# EAGLE design Temperature Sensor (EAGLE 7.7.0)
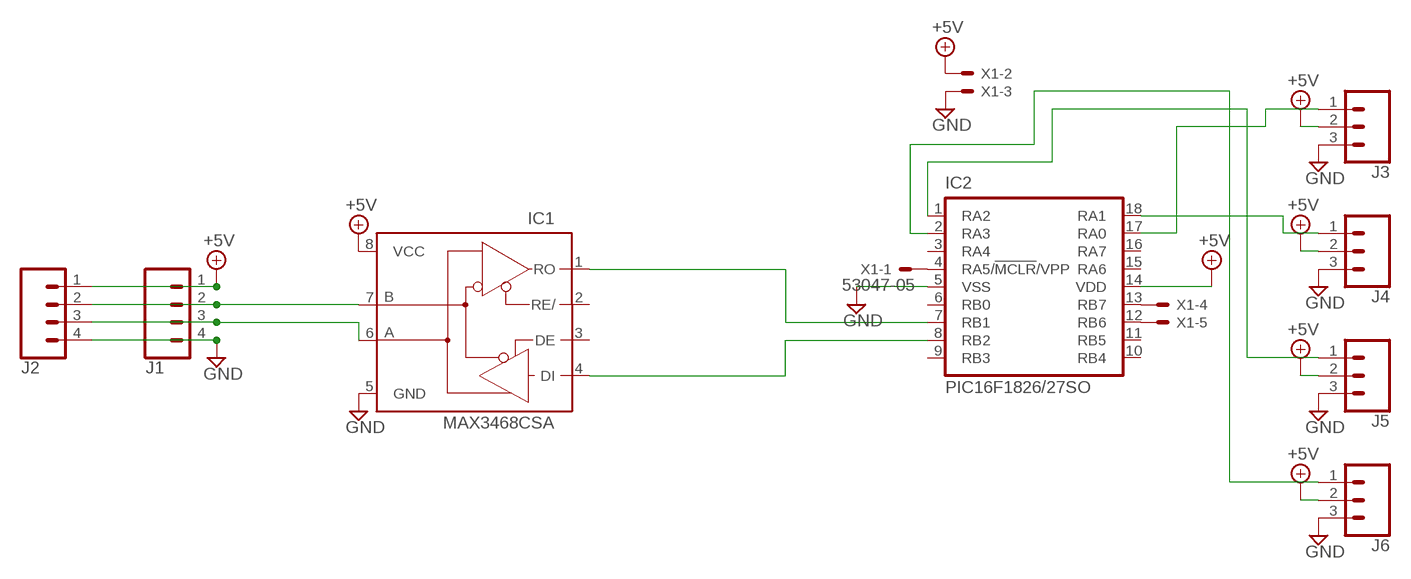
[diagram p0: schematic, sheet 1]

## Parts
IC1  MAX3468CSA  [SO08]
IC2  PIC16F1826/27SO  [SO-18W]
J1  CONN_04SCREW  [SCREWTERMINAL-3.5MM-4]
J2  CONN_04SCREW  [SCREWTERMINAL-3.5MM-4]
J3  CONN_03  [1X03]
J4  CONN_03  [1X03]
J5  CONN_03  [1X03]
J6  CONN_03  [1X03]
X1  53047-05  [53047-05]

## Nets
+5V: IC1.8(VCC) IC2.14(VDD) J1.1 J2.1 J3.2 J4.2 J5.2 J6.2 X1.2
GND: IC1.5(GND) IC2.5(VSS) J1.4 J2.4 J3.3 J4.3 J5.3 J6.3 X1.3
N$1: IC1.1(RO) IC2.7(RB1)
N$2: IC1.4(DI) IC2.8(RB2)
N$5: IC2.4(RA5/!MCLR!/VPP) X1.1
N$6: IC2.13(RB7) X1.4
N$7: IC2.12(RB6) X1.5
N$8: IC1.7(B) J1.2 J2.2
N$9: IC1.6(A) J1.3 J2.3
N$10: IC2.17(RA0) J3.1
N$11: IC2.18(RA1) J4.1
N$12: IC2.1(RA2) J5.1
N$13: IC2.2(RA3) J6.1
Unconnected: IC1.2(RE/) IC1.3(DE) IC2.3(RA4) IC2.6(RB0) IC2.9(RB3) IC2.10(RB4) IC2.11(RB5) IC2.15(RA6) IC2.16(RA7)

## Library data of the parts
IC1 = maxim:MAX34*: +5V, Fail-Safe, 40Mbps, Profibus RS-485/RS-422 Transceivers Source: MAX3465-MAX3469.pdf; MPN: MAX3468CSA+; OC_FARNELL: unknown; OC_NEWARK: 76K6721
IC2 = microchip:PIC16*F1826/27: 18/20/28-Pin Flash Microcontrollers with nanoWatt XLP Technology Source: www.microchip.com PIC16F1827.pdf
J1 J2 = SparkFun-Connectors:CONN_04: Multi connection point. Often used as Generic Header-pin footprint for 0.1 inch spaced/style header connections On any of the 0.1 inch spaced packages, you can populate with these: Break Away Headers - Straight <https://www.sparkfun.com/products/116> (PRT-00116) Break Away Male Headers - Right Angle <https://www.sparkfun.com/products/553> (PRT-00553) Female Headers <https://www.sparkfun.com/products/115> (PRT-00115) Break Away Headers - Machine Pin <https://www.sparkfun.com/products/117> (PRT-00117) Break Away Female Headers - Swiss Machine Pin <https://www.sparkfun.com/products/743> (PRT-00743) For SCREWTERMINALS and SPRING TERMINALS visit here: Screw Terimnals on SparkFun.com <https://www.sparkfun.com/search/results?term=Screw+Terminals> (5mm/3.5mm/2.54mm spacing) This device is also useful as a general connection point to wire up your design to another part of your project. Our various solder wires solder well into these plated through hole pads. Hook-Up Wire - Assortment (Stranded, 22 AWG) <https://www.sparkfun.com/products/11375> (PRT-11375) Hook-Up Wire - Assortment (Solid Core, 22 AWG) <https://www.sparkfun.com/products/11367> (PRT-11367) View the entire wire category on our website here <https://www.sparkfun.com/categories/141> Special notes: Molex polarized connector foot print use with SKU : PRT-08231 with associated crimp pins and housings. 1MM SMD Version SKU: PRT-10208; PROD_ID: 2xCONN-08399; SF_ID: 2xPRT-08084
J3-J6 = SparkFun-Connectors:CONN_03: Multi connection point. Often used as Generic Header-pin footprint for 0.1 inch spaced/style header connections On any of the 0.1 inch spaced packages, you can populate with these: Break Away Headers - Straight <https://www.sparkfun.com/products/116> (PRT-00116) Break Away Male Headers - Right Angle <https://www.sparkfun.com/products/553> (PRT-00553) Female Headers <https://www.sparkfun.com/products/115> (PRT-00115) Break Away Headers - Machine Pin <https://www.sparkfun.com/products/117> (PRT-00117) Break Away Female Headers - Swiss Machine Pin <https://www.sparkfun.com/products/743> (PRT-00743) Stackable Header - 3 Pin (Female, 0.1") <https://www.sparkfun.com/products/13875> (PRT-13875) For SCREWTERMINALS and SPRING TERMINALS visit here: Screw Terimnals on SparkFun.com <https://www.sparkfun.com/search/results?term=Screw+Terminals> (5mm/3.5mm/2.54mm spacing) This device is also useful as a general connection point to wire up your design to another part of your project. Our various solder wires solder well into these plated through hole pads. Hook-Up Wire - Assortment (Stranded, 22 AWG) <https://www.sparkfun.com/products/11375> (PRT-11375) Hook-Up Wire - Assortment (Solid Core, 22 AWG) <https://www.sparkfun.com/products/11367> (PRT-11367) View the entire wire category on our website here <https://www.sparkfun.com/categories/141> Special notes: Molex polarized connector foot print use with SKU : PRT-08232 with associated crimp pins and housings.
X1 = con-molex:53?-05: CONNECTOR wire to board 1.25 mm (.049 inch) pitch header; MF: MOLEX; MPN: 53047-0510; OC_FARNELL: 9732861; OC_NEWARK: 38C9901

## Board
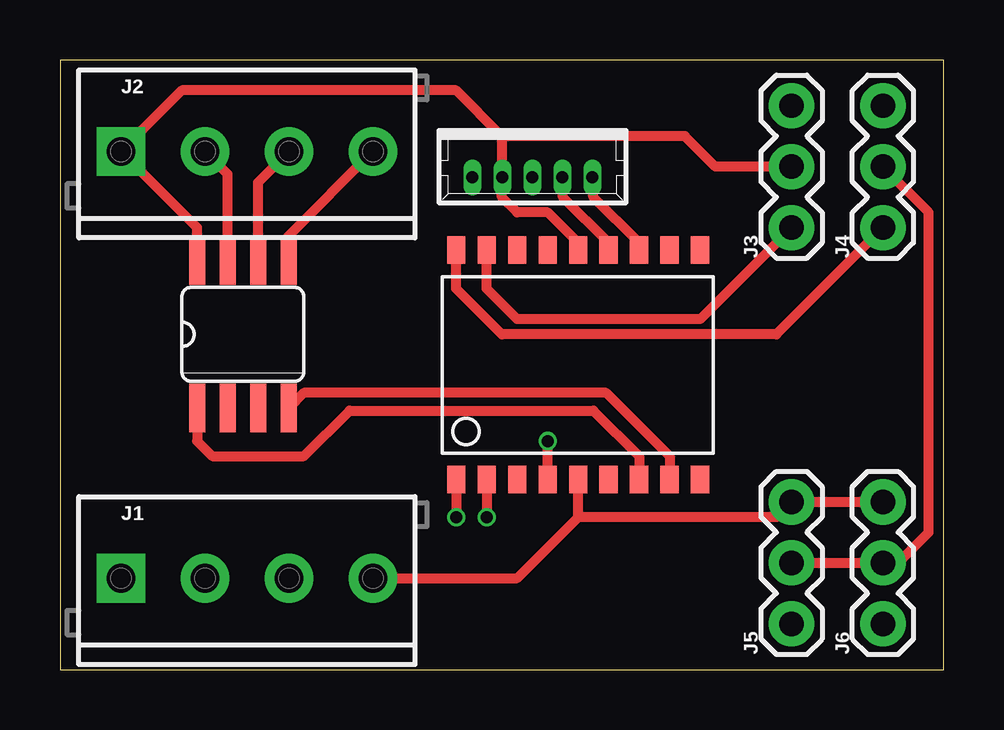
[diagram p1: board, top side]
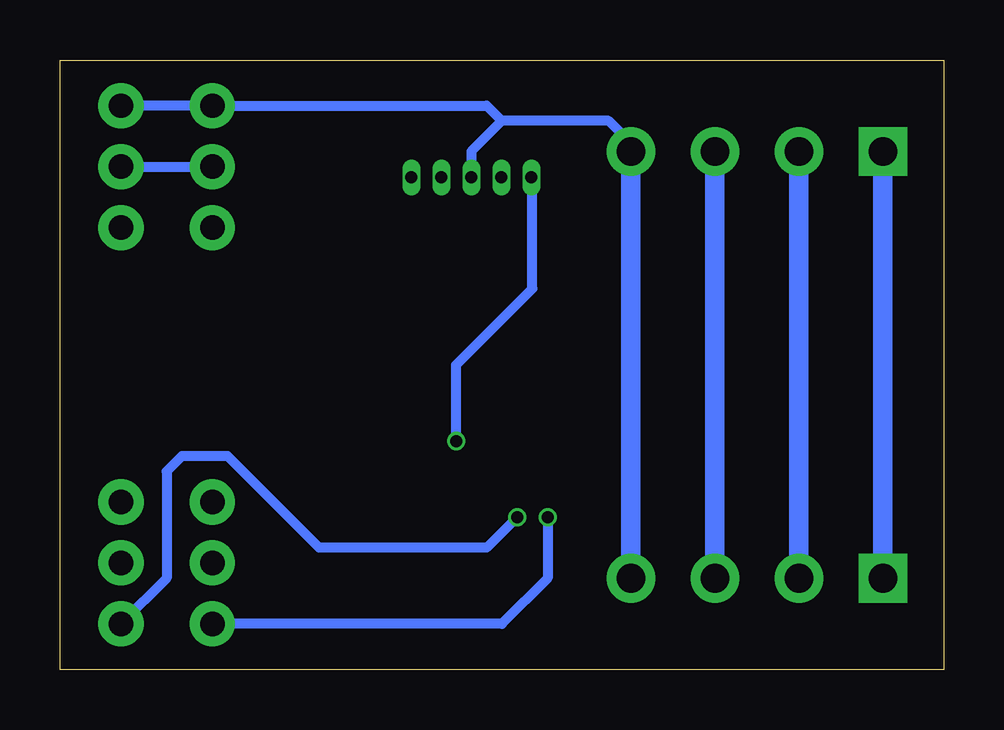
[diagram p2: board, bottom side, seen from below]

Size 36.83 x 25.4 mm. Coordinates in mm from the lower left corner, seen from the top.
Outline: 0,0 36.83,0 36.83,25.4 0,25.4 0,0
Copper layers (1*16): Top 0.035559375mm / dielectric 1.6mm / Bottom 0.035559375mm
Design rules "oshpark-2layer": minimum track width 6mil, minimum drill 10mil, track to track 6mil, track to pad 6mil, pad to pad 6mil, via to via 6mil, smd to smd 6mil, copper to edge 15mil, drill to drill 6mil, minimum pad ring 5mil, minimum via ring 5mil, stop-mask expansion 2.5mil, vias tented up to drill 0mil, thermal gap 10mil

### Footprints (pad centres in the part's own frame; a part is rotated, then mirrored left to right if it is on the bottom)
SO08 = smd 0.66 x 2.032: 1 -1.905,-3.073; 2 -0.635,-3.073; 3 0.635,-3.073; 4 1.905,-3.073; 5 1.905,3.073; 6 0.635,3.073; 7 -0.635,3.073; 8 -1.905,3.073
SO-18W = smd 0.762 x 1.143: 1 -5.08,-4.788; 2 -3.81,-4.788; 3 -2.54,-4.788; 4 -1.27,-4.788; 5 0,-4.788; 6 1.27,-4.788; 7 2.54,-4.788; 8 3.81,-4.788; 9 5.08,-4.788; 10 5.08,4.788; 11 3.81,4.788; 12 2.54,4.788; 13 1.27,4.788; 14 0,4.788; 15 -1.27,4.788; 16 -2.54,4.788; 17 -3.81,4.788; 18 -5.08,4.788
SCREWTERMINAL-3.5MM-4 = drill 1.2 pad 2.032 square: 1 0,0 | drill 1.2 pad 2.032: 2 3.5,0; 3 7,0; 4 10.5,0
1X03 = drill 1.016 pad 1.88: 1 0,0; 2 2.54,0; 3 5.08,0
53047-05 = drill 0.5 pad 0.698 long: 1 2.5,0.45; 2 1.25,0.45; 3 0,0.45; 4 -1.25,0.45; 5 -2.5,0.45

### Placement (x,y rotation side)
IC1  7.62,13.97 0 top
IC2  21.59,12.7 0 top
J1  2.54,3.81 0 top
J2  2.54,21.59 0 top
J3  30.48,18.41 90 top
J4  34.29,18.41 90 top
J5  30.48,1.91 90 top
J6  34.29,1.91 90 top
X1  19.68,20.95 180 top

### Tracks (layer width: path | path; a pad name or v marks a point on that pad's centre or on a via)
+5V
  Top 0.406: IC1.8 5.71,18.41 J2.1 5.08,24.13 16.51,24.13 18.41,22.23 | 18.41,22.23 18.43,22.2 X1.2 18.41,20.48 18.41,19.68 19.05,19.05 20.32,19.05 21.59,17.78 IC2.14 | J5.2 J6.2 34.92,4.45 36.2,5.71 36.2,19.05 J4.2 | J3.2 27.3,20.95 26.04,22.23 18.41,22.23
  Bottom 0.406: 18.41,20.48 X1.2 | J4.2 J3.2
  Bottom 0.813: J2.1 J1.1
GND
  Top 0.406: IC1.5 9.53,18.07 J2.4 | J1.4 19.05,3.81 21.59,6.35 | 21.59,6.35 IC2.5 | J6.3 J5.3 29.84,6.35 21.59,6.35
  Bottom 0.406: J2.4 13.04,21.93 13.97,22.86 18.41,22.86 | 18.41,22.86 19.68,21.59 X1.3 | J4.3 J3.3 19.05,23.5 18.41,22.86
  Bottom 0.813: J2.4 J1.4
N$1
  Top 0.406: IC1.1 5.71,9.53 6.35,8.89 10.16,8.89 12.06,10.79 22.23,10.79 24.13,8.89 IC2.7
N$2
  Top 0.406: IC2.8 25.4,8.89 22.76,11.53 10.16,11.53 IC1.4
N$5  (via drill 0.5)
  Top 0.406: IC2.4 v20.32,9.53
  Bottom 0.406: v20.32,9.53 20.32,12.7 17.14,15.88 17.14,20.46 X1.1
N$6
  Top 0.406: IC2.13 22.86,17.78 20.95,19.68 20.95,20.48 X1.4
N$7
  Top 0.406: IC2.12 24.13,17.78 22.23,19.68 22.23,20.46 X1.5
N$8
  Top 0.406: IC1.7 6.99,20.64 J2.2
  Bottom 0.813: J2.2 J1.2
N$9
  Top 0.406: IC1.6 8.26,20.3 J2.3
  Bottom 0.813: J2.3 J1.3
N$10
  Top 0.406: IC2.17 17.78,15.88 19.05,14.61 26.67,14.61 J3.1
N$11
  Top 0.406: J4.1 29.84,13.97 18.41,13.97 16.51,15.88 IC2.18
N$12  (via drill 0.5)
  Top 0.406: IC2.1 v16.51,6.35
  Bottom 0.406: v16.51,6.35 16.51,3.81 18.41,1.91 J5.1
N$13  (via drill 0.5)
  Top 0.406: IC2.2 v17.78,6.35
  Bottom 0.406: v17.78,6.35 19.05,5.08 26.04,5.08 29.84,8.89 31.75,8.89 32.38,8.26 32.38,3.81 J6.1